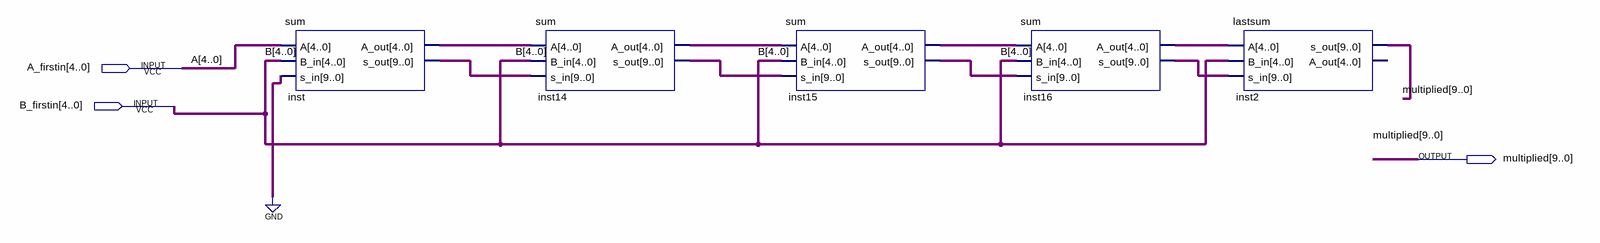
[diagram p0: schematic sheet]
// Quartus schematic multiplier.bdf as structural Verilog: 5 symbols, 3 pins
module multiplier (
  input  [4:0] A_firstin,
  input  [4:0] B_firstin,
  output [9:0] multiplied
);

  wire [4:0] inst14_a_out, inst15_a_out, inst16_a_out, inst_a_out;
  wire [9:0] inst14_s_out, inst15_s_out, inst16_s_out, inst_s_out;

  sum inst (.A(A_firstin), .B_in(B_firstin), .s_in({10{1'b0}}), .A_out(inst_a_out), .s_out(inst_s_out));
  sum inst14 (.A(inst_a_out), .B_in(B_firstin), .s_in(inst_s_out), .A_out(inst14_a_out), .s_out(inst14_s_out));
  sum inst15 (.A(inst14_a_out), .B_in(B_firstin), .s_in(inst14_s_out), .A_out(inst15_a_out), .s_out(inst15_s_out));
  sum inst16 (.A(inst15_a_out), .B_in(B_firstin), .s_in(inst15_s_out), .A_out(inst16_a_out), .s_out(inst16_s_out));
  lastsum inst2 (.A(inst16_a_out), .B_in(B_firstin), .s_in(inst16_s_out), .s_out(multiplied));  // open: A_out

  // Other names for the same wires on the sheet: A[4:0] = A_firstin; B[4:0] = B_firstin
endmodule
